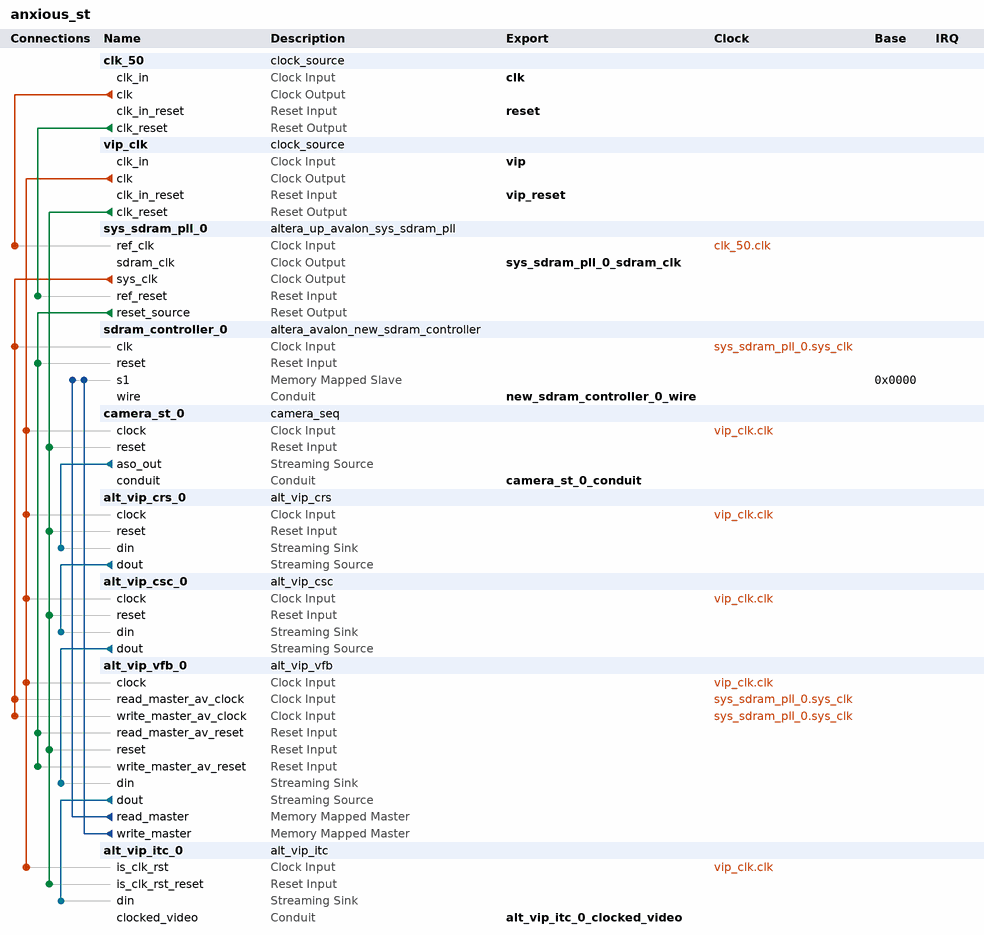
[diagram p0: system contents]
# Platform Designer (Qsys) system anxious_st, Cyclone IV GX EP4CGX150DF31C7
# Parameters at their usual value, and those the tool derives, are not listed.
package require -exact qsys 15.0
create_system anxious_st
set_project_property DEVICE_FAMILY {Cyclone IV GX}
set_project_property DEVICE EP4CGX150DF31C7

add_instance clk_50 clock_source 15.0
set_instance_parameter_value clk_50 clockFrequency 50000000

add_instance vip_clk clock_source 15.0
set_instance_parameter_value vip_clk clockFrequency 100000000

add_instance sys_sdram_pll_0 altera_up_avalon_sys_sdram_pll 15.0
set_instance_parameter_value sys_sdram_pll_0 CIV_boards DE2i-150
set_instance_parameter_value sys_sdram_pll_0 CV_boards DE1-SoC
set_instance_parameter_value sys_sdram_pll_0 gui_outclk 50.0
set_instance_parameter_value sys_sdram_pll_0 gui_refclk 50.0

add_instance sdram_controller_0 altera_avalon_new_sdram_controller 15.0
set_instance_parameter_value sdram_controller_0 TAC 5.5
set_instance_parameter_value sdram_controller_0 TRCD 20.0
set_instance_parameter_value sdram_controller_0 TRP 20.0
set_instance_parameter_value sdram_controller_0 casLatency 3
set_instance_parameter_value sdram_controller_0 columnWidth 10
set_instance_parameter_value sdram_controller_0 dataWidth 32
set_instance_parameter_value sdram_controller_0 generateSimulationModel false
set_instance_parameter_value sdram_controller_0 initRefreshCommands 8
set_instance_parameter_value sdram_controller_0 model single_Micron_MT48LC4M32B2_7_chip
set_instance_parameter_value sdram_controller_0 numberOfBanks 4
set_instance_parameter_value sdram_controller_0 numberOfChipSelects 1
set_instance_parameter_value sdram_controller_0 powerUpDelay 100.0
set_instance_parameter_value sdram_controller_0 refreshPeriod 7.8125
set_instance_parameter_value sdram_controller_0 rowWidth 13

add_instance camera_st_0 camera_seq 1.0
set_instance_parameter_value camera_st_0 DATA_WIDTH 8
set_instance_parameter_value camera_st_0 FIFO_LENGTH_LOG_2 8

add_instance alt_vip_crs_0 alt_vip_crs 13.1
set_instance_parameter_value alt_vip_crs_0 IN_CHANNELS_IN_PAR 1
set_instance_parameter_value alt_vip_crs_0 OUT_CHANNELS_IN_PAR 1
set_instance_parameter_value alt_vip_crs_0 PARAMETERISATION {<chromaResamplerParams><CRS_NAME>chroma_resampler</CRS_NAME><CRS_BPS>8</CRS_BPS><CRS_WIDTH>640</CRS_WIDTH><CRS_HEIGHT>480</CRS_HEIGHT><CRS_PARALLEL_MODE>false</CRS_PARALLEL_MODE><CRS_RESAMPLING><FORMAT><IN>422</IN><OUT>444</OUT></FORMAT><COSITING><V>true</V><H>true</H></COSITING></CRS_RESAMPLING><CRS_ALGORITHM><V><NAME>INTERPOLATION_1D_NEAREST_NEIGHBOUR</NAME><LUMA_ADAPTIVE>false</LUMA_ADAPTIVE></V><H><NAME>INTERPOLATION_1D_FULL_FILTERING</NAME><LUMA_ADAPTIVE>true</LUMA_ADAPTIVE></H></CRS_ALGORITHM></chromaResamplerParams>}

add_instance alt_vip_csc_0 alt_vip_csc 13.1
set_instance_parameter_value alt_vip_csc_0 PARAMETERISATION {<cscParams> <CSC_NAME>a_csc</CSC_NAME> <CSC_CHANNELS_IN_SEQ>3</CSC_CHANNELS_IN_SEQ>  <CSC_CHANNELS_IN_PAR>1</CSC_CHANNELS_IN_PAR>  <CSC_INPUT_OUTPUT_DATATYPES>   <IODT_INPUT_BPS>8</IODT_INPUT_BPS>   <IODT_OUTPUT_BPS>8</IODT_OUTPUT_BPS>   <IODT_INPUT_DATA_TYPE>DATA_TYPE_UNSIGNED</IODT_INPUT_DATA_TYPE>   <IODT_OUTPUT_DATA_TYPE>DATA_TYPE_UNSIGNED</IODT_OUTPUT_DATA_TYPE>   <IODT_USE_INPUT_GUARD_BANDS>false</IODT_USE_INPUT_GUARD_BANDS>   <IODT_INPUT_GUARD_MIN>0</IODT_INPUT_GUARD_MIN>   <IODT_INPUT_GUARD_MAX>255</IODT_INPUT_GUARD_MAX>   <IODT_USE_OUTPUT_GUARD_BANDS>false</IODT_USE_OUTPUT_GUARD_BANDS>   <IODT_OUTPUT_GUARD_MIN>0</IODT_OUTPUT_GUARD_MIN>   <IODT_OUTPUT_GUARD_MAX>255</IODT_OUTPUT_GUARD_MAX>  </CSC_INPUT_OUTPUT_DATATYPES>  <CSC_PREDEFINED_CONVERSION>SDTV_YCBCR_TO_CRGB</CSC_PREDEFINED_CONVERSION>  <CSC_COEFFICIENTS><row><mult>2.018</mult><mult>0.0</mult><mult>1.164</mult><add>-276.928</add></row><row><mult>-0.391</mult><mult>-0.813</mult><mult>1.164</mult><add>135.488</add></row><row><mult>0.0</mult><mult>1.596</mult><mult>1.164</mult><add>-222.912</add></row></CSC_COEFFICIENTS>  <CSC_COEFF_PRECISION>   <CPC_INTEGER_BITS>0</CPC_INTEGER_BITS>   <CPC_FRACTION_BITS>8</CPC_FRACTION_BITS>   <CPC_COEFFS_SIGNED>true</CPC_COEFFS_SIGNED>  </CSC_COEFF_PRECISION>  <CSC_SUMM_PRECISION>   <CPC_INTEGER_BITS>8</CPC_INTEGER_BITS>   <CPC_FRACTION_BITS>8</CPC_FRACTION_BITS>   <CPC_COEFFS_SIGNED>false</CPC_COEFFS_SIGNED>  </CSC_SUMM_PRECISION>  <CSC_OUTPUT_CONVERSION>   <ODTC_SCALE>0</ODTC_SCALE>   <ODTC_FIXEDPOINT_TO_INTEGER>FRACTION_BITS_ROUND_HALF_UP</ODTC_FIXEDPOINT_TO_INTEGER>   <ODTC_CONVERT_SIGNED_TO_UNSIGNED>CONVERT_TO_UNSIGNED_SATURATE</ODTC_CONVERT_SIGNED_TO_UNSIGNED>  </CSC_OUTPUT_CONVERSION> <CSC_RUNTIME_COEFFICIENTS>false</CSC_RUNTIME_COEFFICIENTS> </cscParams>}

add_instance alt_vip_vfb_0 alt_vip_vfb 13.1

add_instance alt_vip_itc_0 alt_vip_itc 14.0
set_instance_parameter_value alt_vip_itc_0 COLOUR_PLANES_ARE_IN_PARALLEL 0
set_instance_parameter_value alt_vip_itc_0 FIFO_DEPTH 640
set_instance_parameter_value alt_vip_itc_0 H_ACTIVE_PIXELS 640
set_instance_parameter_value alt_vip_itc_0 H_BACK_PORCH 48
set_instance_parameter_value alt_vip_itc_0 H_FRONT_PORCH 16
set_instance_parameter_value alt_vip_itc_0 H_SYNC_LENGTH 96
set_instance_parameter_value alt_vip_itc_0 NUMBER_OF_COLOUR_PLANES 3
set_instance_parameter_value alt_vip_itc_0 THRESHOLD 639
set_instance_parameter_value alt_vip_itc_0 V_ACTIVE_LINES 480
set_instance_parameter_value alt_vip_itc_0 V_BACK_PORCH 33
set_instance_parameter_value alt_vip_itc_0 V_FRONT_PORCH 10
set_instance_parameter_value alt_vip_itc_0 V_SYNC_LENGTH 2

# connections
add_connection clk_50.clk sys_sdram_pll_0.ref_clk clock
add_connection sys_sdram_pll_0.sys_clk alt_vip_vfb_0.read_master_av_clock clock
add_connection sys_sdram_pll_0.sys_clk alt_vip_vfb_0.write_master_av_clock clock
add_connection sys_sdram_pll_0.sys_clk sdram_controller_0.clk clock
add_connection vip_clk.clk alt_vip_crs_0.clock clock
add_connection vip_clk.clk alt_vip_csc_0.clock clock
add_connection vip_clk.clk alt_vip_itc_0.is_clk_rst clock
add_connection vip_clk.clk alt_vip_vfb_0.clock clock
add_connection vip_clk.clk camera_st_0.clock clock
add_connection clk_50.clk_reset sys_sdram_pll_0.ref_reset reset
add_connection sys_sdram_pll_0.reset_source alt_vip_vfb_0.read_master_av_reset reset
add_connection sys_sdram_pll_0.reset_source alt_vip_vfb_0.write_master_av_reset reset
add_connection sys_sdram_pll_0.reset_source sdram_controller_0.reset reset
add_connection vip_clk.clk_reset alt_vip_crs_0.reset reset
add_connection vip_clk.clk_reset alt_vip_csc_0.reset reset
add_connection vip_clk.clk_reset alt_vip_itc_0.is_clk_rst_reset reset
add_connection vip_clk.clk_reset alt_vip_vfb_0.reset reset
add_connection vip_clk.clk_reset camera_st_0.reset reset
add_connection alt_vip_vfb_0.read_master sdram_controller_0.s1 avalon
set_connection_parameter_value alt_vip_vfb_0.read_master/sdram_controller_0.s1 baseAddress 0x0000
add_connection alt_vip_vfb_0.write_master sdram_controller_0.s1 avalon
set_connection_parameter_value alt_vip_vfb_0.write_master/sdram_controller_0.s1 baseAddress 0x0000
add_connection alt_vip_crs_0.dout alt_vip_csc_0.din avalon_streaming
add_connection alt_vip_csc_0.dout alt_vip_vfb_0.din avalon_streaming
add_connection alt_vip_vfb_0.dout alt_vip_itc_0.din avalon_streaming
add_connection camera_st_0.aso_out alt_vip_crs_0.din avalon_streaming

# exported interfaces
add_interface alt_vip_itc_0_clocked_video conduit end
set_interface_property alt_vip_itc_0_clocked_video EXPORT_OF alt_vip_itc_0.clocked_video
add_interface camera_st_0_conduit conduit end
set_interface_property camera_st_0_conduit EXPORT_OF camera_st_0.conduit
add_interface clk clock sink
set_interface_property clk EXPORT_OF clk_50.clk_in
add_interface new_sdram_controller_0_wire conduit end
set_interface_property new_sdram_controller_0_wire EXPORT_OF sdram_controller_0.wire
add_interface reset reset sink
set_interface_property reset EXPORT_OF clk_50.clk_in_reset
add_interface sys_sdram_pll_0_sdram_clk clock source
set_interface_property sys_sdram_pll_0_sdram_clk EXPORT_OF sys_sdram_pll_0.sdram_clk
add_interface vip clock sink
set_interface_property vip EXPORT_OF vip_clk.clk_in
add_interface vip_reset reset sink
set_interface_property vip_reset EXPORT_OF vip_clk.clk_in_reset

set_interconnect_requirement {$system} qsys_mm.clockCrossingAdapter HANDSHAKE
set_interconnect_requirement {$system} qsys_mm.enableEccProtection FALSE
set_interconnect_requirement {$system} qsys_mm.insertDefaultSlave FALSE
set_interconnect_requirement {$system} qsys_mm.maxAdditionalLatency 1
set_interconnect_requirement new_target new_requirement_name new_requirement_value
set_interconnect_requirement new_target new_requirement_name_0 new_requirement_value
set_interconnect_requirement new_target new_requirement_name_1 new_requirement_value

save_system anxious_st.qsys
